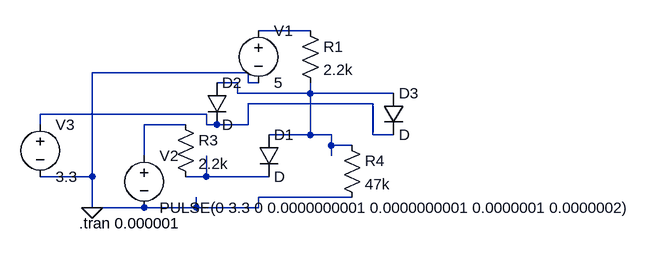
[diagram p0: schematic DiodeOffsetPullup.asc]
DiodeOffsetPullup.asc, the LTspice schematic file:
Version 4
SHEET 1 880 680
WIRE 224 16 144 16
WIRE 128 80 -112 80
WIRE 112 96 80 96
WIRE 128 96 128 80
WIRE 144 96 128 96
WIRE 112 112 112 96
WIRE 224 112 224 96
WIRE 224 112 112 112
WIRE 352 112 224 112
WIRE 320 128 128 128
WIRE 64 144 -192 144
WIRE -192 160 -192 144
WIRE 32 160 -32 160
WIRE 64 160 64 144
WIRE 80 160 64 160
WIRE 128 160 128 128
WIRE 128 160 80 160
WIRE 224 176 224 112
WIRE 224 176 160 176
WIRE 256 176 224 176
WIRE 320 176 320 128
WIRE 352 176 320 176
WIRE 256 192 256 176
WIRE 288 192 256 192
WIRE -32 208 -32 160
WIRE 256 208 256 192
WIRE -112 240 -112 80
WIRE -112 240 -192 240
WIRE 64 240 64 208
WIRE 64 240 32 240
WIRE 160 240 64 240
WIRE 288 272 144 272
WIRE -112 288 -112 240
WIRE -32 288 -112 288
WIRE 48 288 48 272
WIRE 48 288 -32 288
WIRE 144 288 144 272
WIRE 144 288 48 288
FLAG -112 288 0
SYMBOL voltage 144 0 R0
SYMATTR InstName V1
SYMATTR Value 5
SYMBOL voltage -32 192 R0
WINDOW 123 0 0 Left 2
WINDOW 39 0 0 Left 2
SYMATTR InstName V2
SYMATTR Value PULSE(0 3.3 0 0.0000000001 0.0000000001 0.0000001 0.0000002)
SYMBOL res 16 144 R0
SYMATTR InstName R3
SYMATTR Value 2.2k
SYMBOL res 272 176 R0
SYMATTR InstName R4
SYMATTR Value 47k
SYMBOL res 208 0 R0
SYMATTR InstName R1
SYMATTR Value 2.2k
SYMBOL diode 64 96 R0
SYMATTR InstName D2
SYMBOL voltage -192 144 R0
SYMATTR InstName V3
SYMATTR Value 3.3
SYMBOL diode 144 176 R0
SYMATTR InstName D1
SYMBOL diode 336 112 R0
SYMATTR InstName D3
TEXT -132 312 Left 2 !.tran 0.000001

The netlist it stands for:
* DiodeOffsetPullup.asc
V1 N001 0 5
V2 N004 0 PULSE(0 3.3 0 0.0000000001 0.0000000001 0.0000001 0.0000002)
R3 N004 N005 2.2k
R4 N002 0 47k
R1 N001 N002 2.2k
D2 N002 N003 D
V3 N003 0 3.3
D1 N002 N005 D
D3 N002 N003 D
.model D D
.lib standard.dio
.tran 0.000001
.backanno
.end